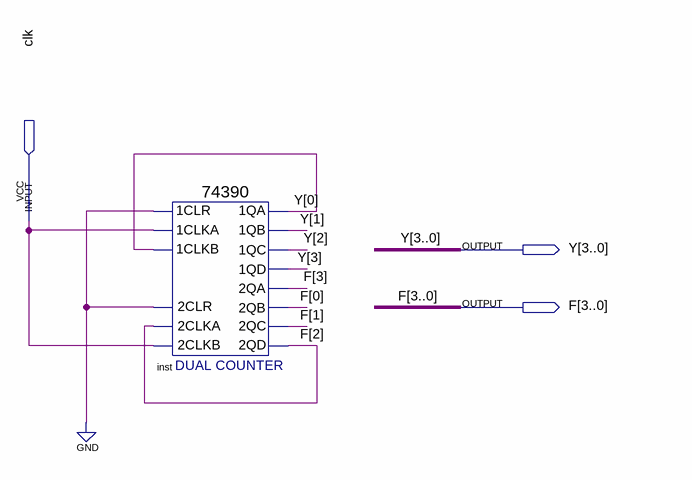
[diagram p0: schematic sheet]
// Quartus schematic lab_1.bdf as structural Verilog: 1 symbols, 3 pins
module lab_1 (
  input  clk,
  output [3:0] Y,
  output [3:0] F
);

  \74390  inst (
    .\2CLKA (F[2]), .\2CLR (1'b0), .\2CLKB (clk), .\1CLR (1'b0), .\1CLKA (clk), .\1CLKB (Y[0]), .\1QA (Y[0]),
    .\1QB (Y[1]), .\1QC (Y[2]), .\1QD (Y[3]), .\2QA (F[3]), .\2QB (F[0]), .\2QC (F[1]), .\2QD (F[2]));
endmodule
